# Altium schematic sheet Jukebox Schematic.SchDoc: Jukebox Top Page
size B; DrawnBy: Tim Menninger; Revision: 1.1; SheetNumber: 1; SheetTotal: 5
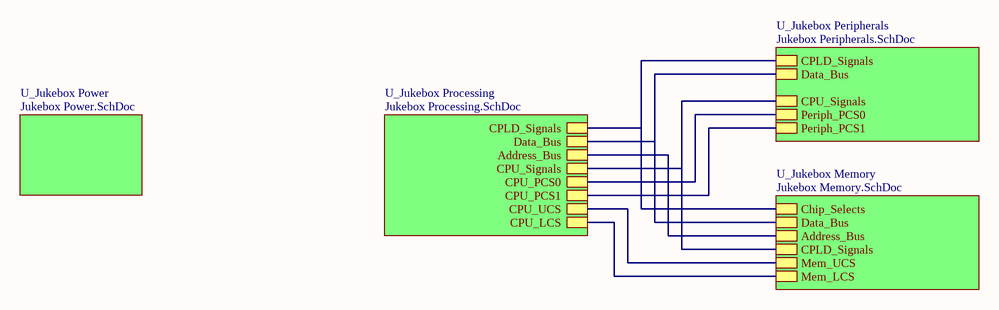
[diagram p0: Jukebox Schematic.SchDoc]

## Sub-sheets
U_Jukebox Memory = Jukebox Memory.SchDoc: Chip_Selects, Data_Bus, Address_Bus, CPLD_Signals, Mem_UCS, Mem_LCS
U_Jukebox Peripherals = Jukebox Peripherals.SchDoc: CPLD_Signals, Data_Bus, CPU_Signals, Periph_PCS0, Periph_PCS1
U_Jukebox Power = Jukebox Power.SchDoc: no entries
U_Jukebox Processing = Jukebox Processing.SchDoc: CPLD_Signals, Data_Bus, Address_Bus, CPU_Signals, CPU_PCS0, CPU_PCS1, CPU_UCS, CPU_LCS

## Nets
(unnamed): sheet U_Jukebox Processing/CPU_PCS0, sheet U_Jukebox Peripherals/Periph_PCS0
(unnamed): sheet U_Jukebox Processing/CPU_PCS1, sheet U_Jukebox Peripherals/Periph_PCS1
(unnamed): sheet U_Jukebox Processing/CPU_UCS, sheet U_Jukebox Memory/Mem_UCS
(unnamed): sheet U_Jukebox Processing/CPU_LCS, sheet U_Jukebox Memory/Mem_LCS

## Buses and harness runs
bus sheet U_Jukebox Memory/Address_Bus = sheet U_Jukebox Processing/Address_Bus
bus sheet U_Jukebox Memory/Chip_Selects = sheet U_Jukebox Peripherals/CPLD_Signals = sheet U_Jukebox Processing/CPLD_Signals
bus sheet U_Jukebox Memory/CPLD_Signals = sheet U_Jukebox Peripherals/CPU_Signals = sheet U_Jukebox Processing/CPU_Signals
bus sheet U_Jukebox Memory/Data_Bus = sheet U_Jukebox Peripherals/Data_Bus = sheet U_Jukebox Processing/Data_Bus